# Altium schematic sheet PDB_first.SchDoc
size A4; SheetNumber: 1; SheetTotal: 1
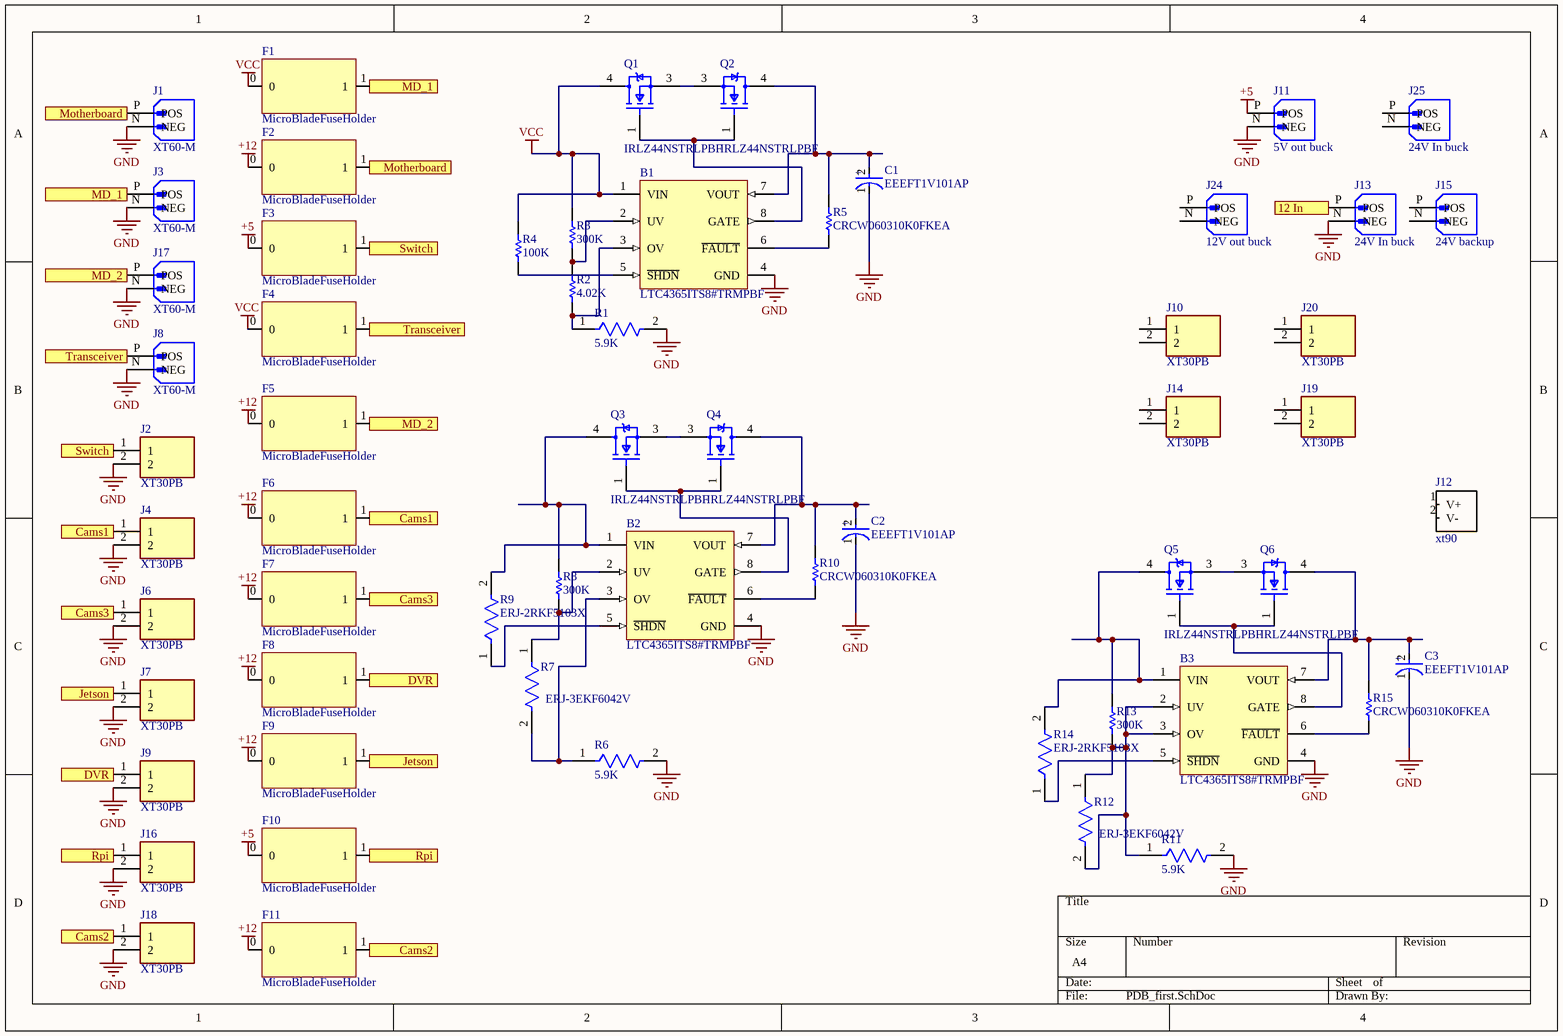
[diagram p0: PDB_first.SchDoc]

## Parts
B1  LTC4365ITS8#TRMPBF  [LT-TS8-8-TSOT-23_V]
B2  LTC4365ITS8#TRMPBF  [LT-TS8-8-TSOT-23_V]
B3  LTC4365ITS8#TRMPBF  [LT-TS8-8-TSOT-23_V]
C1  EEEFT1V101AP  [FP-FTD-MFG]
C2  EEEFT1V101AP  [FP-FTD-MFG]
C3  EEEFT1V101AP  [FP-FTD-MFG]
F1  MicroBladeFuseHolder
F2  MicroBladeFuseHolder
F3  MicroBladeFuseHolder
F4  MicroBladeFuseHolder
F5  MicroBladeFuseHolder
F6  MicroBladeFuseHolder
F7  MicroBladeFuseHolder
F8  MicroBladeFuseHolder
F9  MicroBladeFuseHolder
F10  MicroBladeFuseHolder
F11  MicroBladeFuseHolder
J1  XT60-M  [AMASS_XT60-M]
J2  XT30PB  [XT30PB]
J3  XT60-M  [AMASS_XT60-M]
J4  XT30PB  [XT30PB]
J6  XT30PB  [XT30PB]
J7  XT30PB  [XT30PB]
J8  XT60-M  [AMASS_XT60-M]
J9  XT30PB  [XT30PB]
J10  XT30PB  [XT30PB]
J11  5V out buck  [AMASS_XT60-M]
J12  xt90  [xt90]
J13  24V In buck  [AMASS_XT60-M]
J14  XT30PB  [XT30PB]
J15  24V backup  [AMASS_XT60-M]
J16  XT30PB  [XT30PB]
J17  XT60-M  [AMASS_XT60-M]
J18  XT30PB  [XT30PB]
J19  XT30PB  [XT30PB]
J20  XT30PB  [XT30PB]
J24  12V out buck  [AMASS_XT60-M]
J25  24V In buck  [AMASS_XT60-M]
Q1  IRLZ44NSTRLPBF  [FP-PG-TO263-3-MFG]
Q2  IRLZ44NSTRLPBF  [FP-PG-TO263-3-MFG]
Q3  IRLZ44NSTRLPBF  [FP-PG-TO263-3-MFG]
Q4  IRLZ44NSTRLPBF  [FP-PG-TO263-3-MFG]
Q5  IRLZ44NSTRLPBF  [FP-PG-TO263-3-MFG]
Q6  IRLZ44NSTRLPBF  [FP-PG-TO263-3-MFG]
R1  5.9K  [FP-ERJ2RK-IPC_A]
R2  4.02K  [RESC1608X55X30LL15T15]
R3  300K  [RESC2013X70X40ML20T20]
R4  100K  [RESC1608X55X30ML15T15]
R5  CRCW060310K0FKEA  [RESC1609X50X30NL8T20]
R6  5.9K  [FP-ERJ2RK-IPC_A]
R7  ERJ-3EKF6042V  [FP-ERJ3EK-MFG]
R8  300K  [RESC2013X70X40ML20T20]
R9  ERJ-2RKF5103X  [FP-ERJ2RK-IPC_B]
R10  CRCW060310K0FKEA  [RESC1609X50X30NL8T20]
R11  5.9K  [FP-ERJ2RK-IPC_A]
R12  ERJ-3EKF6042V  [FP-ERJ3EK-MFG]
R13  300K  [RESC2013X70X40ML20T20]
R14  ERJ-2RKF5103X  [FP-ERJ2RK-IPC_B]
R15  CRCW060310K0FKEA  [RESC1609X50X30NL8T20]

## Ports
12 In, Cams1, Cams2, Cams3, DVR, Jetson, MD_1, MD_2, Motherboard, Rpi, Switch, Transceiver

## Nets
+5: F3.0 F10.0 J11.P(POS)
+12: F2.0 F5.0 F6.0 F7.0 F8.0 F9.0 F11.0
GND: B1.4(GND) B2.4(GND) B3.4(GND) C1.1(C) C2.1(C) C3.1(C) J1.N(NEG) J2.2 J3.N(NEG) J4.2 J6.2 J7.2 J8.N(NEG) J9.2 J11.N(NEG) J13.N(NEG) J16.2 J17.N(NEG) J18.2 R1.2 R6.2 R11.2
VCC: B1.1(VIN) F1.0 F4.0 Q1.4(D) R3.2 R4.2
12 In: J13.P(POS) ; port 12 In
Cams1: F6.1 J4.1 ; port Cams1
Cams2: F11.1 J18.1 ; port Cams2
Cams3: F7.1 J6.1 ; port Cams3
DVR: F8.1 J9.1 ; port DVR
Jetson: F9.1 J7.1 ; port Jetson
MD_1: F1.1 J3.P(POS) ; port MD_1
MD_2: F5.1 J17.P(POS) ; port MD_2
Motherboard: F2.1 J1.P(POS) ; port Motherboard
Rpi: F10.1 J16.1 ; port Rpi
Switch: F3.1 J2.1 ; port Switch
Transceiver: F4.1 J8.P(POS) ; port Transceiver
NetB1_2: B1.2(UV) R2.2 R3.1
NetB1_3: B1.3(OV) R1.1 R2.1
NetB1_5: B1.5(~{SHDN}) R4.1
NetB1_6: B1.6(~{FAULT}) R5.1
NetB1_7: B1.7(VOUT) C1.2(A) Q2.4(D) R5.2
NetB1_8: B1.8(GATE) Q1.1(G) Q2.1(G)
NetB2_1: B2.1(VIN) Q3.4(D) R8.2 R9.2
NetB2_2: B2.2(UV) R7.1 R8.1
NetB2_3: B2.3(OV) R6.1 R7.2
NetB2_5: B2.5(~{SHDN}) R9.1
NetB2_6: B2.6(~{FAULT}) R10.1
NetB2_7: B2.7(VOUT) C2.2(A) Q4.4(D) R10.2
NetB2_8: B2.8(GATE) Q3.1(G) Q4.1(G)
NetB3_1: B3.1(VIN) Q5.4(D) R13.2 R14.2
NetB3_2: B3.2(UV) B3.3(OV) R11.1 R12.1 R12.2 R13.1
NetB3_5: B3.5(~{SHDN}) R14.1
NetB3_6: B3.6(~{FAULT}) R15.1
NetB3_7: B3.7(VOUT) C3.2(A) Q6.4(D) R15.2
NetB3_8: B3.8(GATE) Q5.1(G) Q6.1(G)
NetQ1_3: Q1.3(S) Q2.3(S)
NetQ3_3: Q3.3(S) Q4.3(S)
NetQ5_3: Q5.3(S) Q6.3(S)

Not connected (* = marked no-connect by the designer): J10 1 2; J12 1(V+) 2(V-); J14 1 2; J15 N(NEG) P(POS); J19 1 2; J20 1 2; J24 N(NEG) P(POS); J25 N(NEG) P(POS)

## Notes on the sheet
- (in symbol CMP-05427-000027-1) +

## Library data of the parts
B1-B3 = CMP-0474-00861-1: UV, OV and Reverse Supply Protection Controller, 2.5 to 34 V Vin, 8-pin SOT23 (TS8-8), -40 to 85 degC, Pb-Free, Mini Tape and Reel; Manufacturer: Linear Technology; Fault: yes; Fast Comparator: no; Extended Temp: C, I, H; Circuit Breakers(#): 1; RoHS: TRUE; ComponentLink2URL: http://cds.linear.com/docs/en/datasheet/4365f.pdf; PartNumber: LTC4365ITS8#TRMPBF; ComponentLink3Description: Package Specification; Power Good: no; Packing: Mini Tape and Reel; ComponentLink2Description: Datasheet; Vin Range: 2.5 to 34 V; Active Limiting: no; Foldback: no; Reset: no; ComponentLink3URL: http://cds.linear.com/docs/en/packaging/SOT_8_05-08-1637.pdf; PackageVersion: Rev. A, 08/2010; Code_JEDEC: MO-193; ComponentLink1Description: Manufacturer URL; Mounting Technology: Surface Mount; ComponentLink1URL: http://www.linear.com/; PackageDescription: 8-Pin Plastic TSOT-23, Body 2.9 x 1.63 mm, Pitch 0.65 mm; PackageReference: TS8-8
C1-C3 = CMP-05427-000027-1: CAP ALUM 100UF 20% 35V SMD; Ripple Current: 300mA; Polarity: Polar; Life (Hours): 2000Hour; Lead Diameter: 0.65mm; ESR (Equivalent Series Resistance): 260mR; Leakage Current: 35uA; REACH SVHC: No SVHC; Series: FT; Min Operating Temperature: -55°C; Diameter: 6.3mm; Max Operating Temperature: 105°C; Number of Pins: 2; Package Quantity: 1000; Length: 5.8mm; Lead Pitch: 1.8mm; Voltage: 35V; Construction: Cylindrical; Capacitance: 100uF; Height: 5.8mm; Tolerance: 20%; RoHS Compliant: Yes; Packaging: Tape and Reel; Ripple Current (AC): 300mA; Height - Seated (Max): 0.24inch; Voltage Rating: 35V; Radiation Hardening: No; Contact Plating: Tin; Termination: SMD/SMT; Voltage Rating (DC): 35V; Case/Package: Radial; Mount: Surface Mount
J1 J3 J8 J11 J13 J17 J24 J25 = XT60-M: Plug; DC supply; XT60; male; PIN: 2; for cable; soldered; 30A; 500V; MF: AMASS; Package: Package; SnapEDA_Link: https://www.snapeda.com/parts/XT60-M/AMASS/view-part/?ref=snap; Check_prices: https://www.snapeda.com/parts/XT60-M/AMASS/view-part/?ref=eda; MP: XT60-M; Value: *
  J1 J3 J8 J11 J13 J17: Availability: Not in stock; Price: None
J2 J4 J6 J7 J9 J10 J14 J16 J18 = XT30PB: Connector; Manufacturer_Name: Amass; Datasheet Link: https://www.tme.eu/Document/4acc913878197f8c2e30d4b8cdc47230/XT30UPB%20SPEC.pdf; Height: 10.7mm; Manufacturer_Part_Number: XT30PB
J15 = XT60-M: MF: AMASS; SnapEDA_Link: https://www.snapeda.com/parts/XT60-M/AMASS/view-part/?ref=snap; Package: Package; Value: *; MP: XT60-M; Check_prices: https://www.snapeda.com/parts/XT60-M/AMASS/view-part/?ref=eda
J19 = XT30PB: 12V backup; Manufacturer_Name: Amass; Datasheet Link: https://www.tme.eu/Document/4acc913878197f8c2e30d4b8cdc47230/XT30UPB%20SPEC.pdf; Height: 10.7mm; Manufacturer_Part_Number: XT30PB
J20 = XT30PB: 24V backup; Manufacturer_Name: Amass; Datasheet Link: https://www.tme.eu/Document/4acc913878197f8c2e30d4b8cdc47230/XT30UPB%20SPEC.pdf; Height: 10.7mm; Manufacturer_Part_Number: XT30PB
Q1-Q6 = CMP-32901-000495-1: MOSFET N-CH 55V 47A D2PAK; Rds On Max: 22mR; Input Capacitance: 1.7nF; Turn-On Delay Time: 11ns; Turn-Off Delay Time: 26ns; Power Dissipation: 110W; Element Configuration: Single; Gate to Source Voltage (Vgs): 16V; Drain to Source Resistance: 35mR; Threshold Voltage: 2V; Max Power Dissipation: 3.8W; Lead Free: Contains Lead; Max Dual Supply Voltage: 55V; Width: 0.38inch; Mount: Surface Mount; Continuous Drain Current (ID): 47A; Min Operating Temperature: -55°C; Number of Pins: 3; REACH SVHC: No SVHC; Height: 0.19inch; Length: 0.42inch; Case/Package: D2PAK; Drain to Source Breakdown Voltage: 55V; Packaging: Tape and Reel; Drain to Source Voltage (Vdss): 55V; Halogen Free: Halogen Free; RoHS Compliant: Yes; Max Operating Temperature: 175°C
R1 R6 R11 = CMP-2002-01005-2: RES SMD 5.9K OHM 1% 1/10W 0402; Voltage Rating (DC): 50V; Power Rating: 100mW; Temperature Coefficient: 100ppm/°C; Resistance: 5.9kR; Length: 1mm; Case/Package: 0402; Lead Free: Lead Free; Max Operating Temperature: 155°C; Case Code (Imperial): 0402; Min Operating Temperature: -55°C; Construction: Rectangular; Max Power Dissipation: 100mW; Depth: 0.5mm; Packaging: Tape and Reel; Number of Terminations: 2; Features: Automotive AEC-Q200; Mount: Surface Mount; Width: 0.02inch; Case Code (Metric): 1005; Voltage Rating: 50V; Resistor Type: Thick Film; Series: ERJ; Termination: SMD/SMT; Resistance Tolerance: 1%; Tolerance: 1%; Package Quantity: 1; RoHS Compliant: Yes; Height: 0.016inch; Contact Plating: Tin; Military Standard: Not
R2 = CMP-1012-00578-2: Manufacturer: Panasonic; Part Number: ERJ-3EKF4021V
R3 R8 R13 = CMP-2001-00397-1: Part Number: ERJ-6GEYJ304V; Manufacturer: Panasonic
R4 = CMP-2000-00182-1: Part Number: ERJ-3EKF1003V; Manufacturer: Panasonic
R5 R10 R15 = CMP-1666-00005-4: Chip Resistor, 10 KOhm, +/- 1%, 100 mW, -55 to 155 degC, 0603 (1608 Metric), RoHS, Tape and Reel; Manufacturer: Vishay Semiconductor; Voltage Rating: 75 V; Max Operating Temperature: 155 degC; PackageDescription: 2-Pin Surface Mount Device, Body 1.575 x 0.85 mm; ComponentLink1Description: Manufacturer URL; RoHSCompliant: true; PackageReference: 0603; REACH SVHC: Unknown; Length: 1.55 mm; DatasheetVersion: 06/2012; Packaging: Tape and Reel; Min Operating Temperature: -55 degC; Mounting Technology: Surface Mount; ComponentLink2URL: https://datasheet.ciiva.com/11809/0900766b80d98afc-11809037.pdf; Height: 0.45 mm; ComponentLink2Description: Datasheet; Package Quantity: 5000; ComponentLink1URL: http://www.vishay.com/
R7 R12 = CMP-1012-00711-3: NexarPartId: 55421854; Tolerance: 1%; Resistance: 60.4kΩ; Temperature Coefficient: 100ppm/°C; Voltage Rating: 75V; Max Power Dissipation: 100mW; Voltage Rating (DC): 50V; Lifecycle Status: Production; Min Operating Temperature: -55°C; Lead Free: Lead Free; RoHS: Compliant; Height: 550µm; Width: 787.4µm; Schedule B: 8533210045, 8533210045; Composition: Thick Film; Length: 1.6mm; Number of Terminations: 2; Termination: SMD/SMT; Military Standard: Not; Max Operating Temperature: 155°C; Depth: 800µm; Contact Plating: Tin; Case Code (Metric): 1608; Case/Package: 0603; Mount: Surface Mount; Radiation Hardening: No; REACH SVHC: No SVHC; Power Rating: 100mW; Packaging: Cut Tape; Case Code (Imperial): 0603
R9 R14 = CMP-2002-00972-2: RES SMD 510K OHM 1% 1/10W 0402; Max Power Dissipation: 100mW; Resistance: 510kR; Voltage Rating: 50V; Temperature Coefficient: 100ppm/°C; Case Code (Imperial): 0402; RoHS Compliant: Yes; Max Operating Temperature: 155°C; Length: 1mm; Min Operating Temperature: -55°C; Series: ERJ; Number of Terminations: 2; Technology: THICK FILM; Width: 0.02inch; Mount: Surface Mount; Termination: SMD/SMT; Radiation Hardening: No; Packaging: Tape and Reel; Case Code (Metric): 1005; Construction: Rectangular; REACH SVHC: No SVHC; Military Standard: Not; Resistance Tolerance: 1%; Case/Package: 0402; Lead Free: Lead Free; Height: 0.35mm; Depth: 0.5mm; Package Quantity: 10000; Power Rating: 100mW; Resistor Type: Thick Film; Tolerance: 1%; Contact Plating: Tin; Voltage Rating (DC): 50V